# EAGLE design B301 (EAGLE 6.6.0)
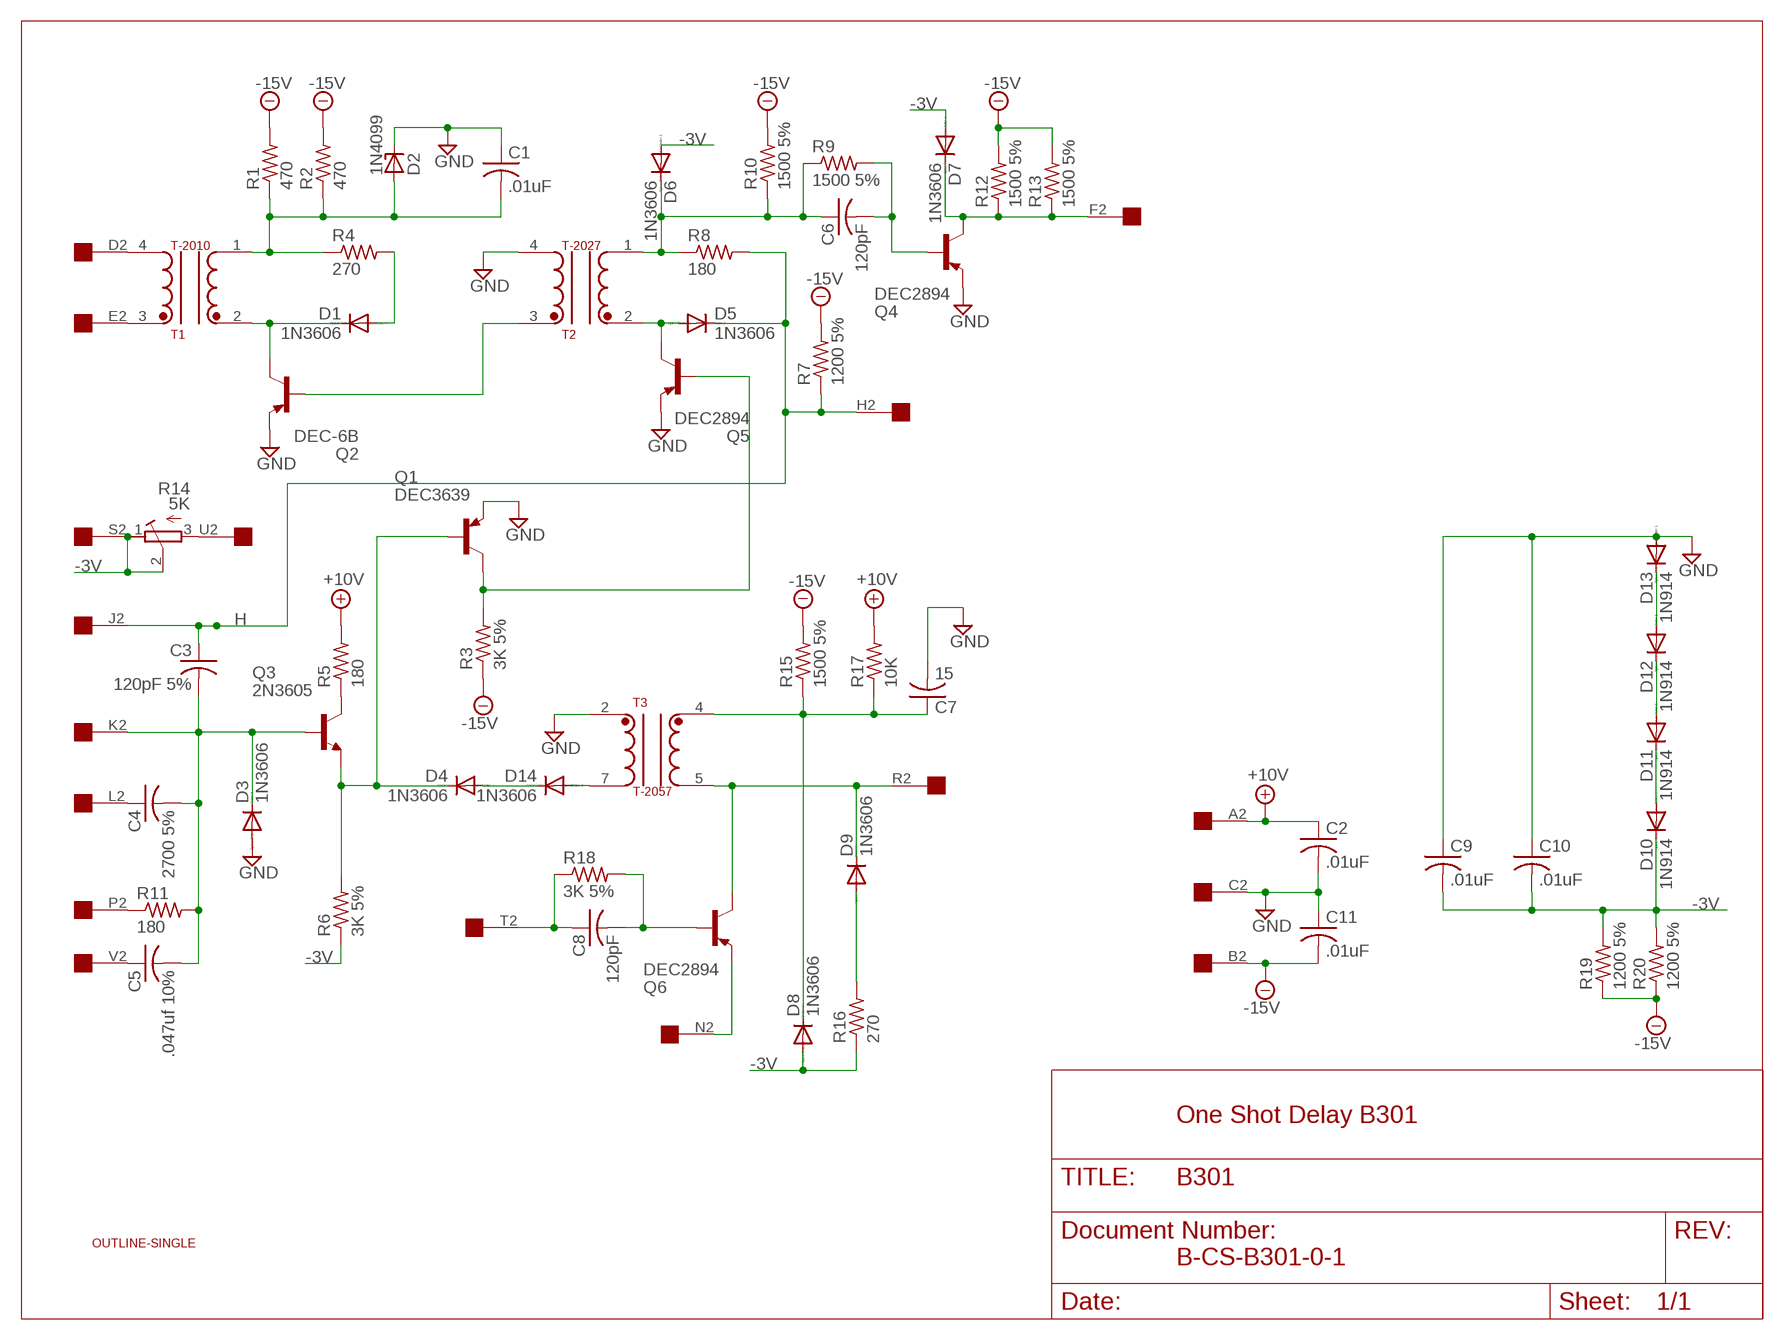
[diagram p0: schematic, sheet 1]

## Parts
C1  .01uF  C-US050-025X075  [C050-025X075]
C2  .01uF  C-US050-025X075  [C050-025X075]
C3  120pF 5%  C-US050-025X075  [C050-025X075]
C4  2700 5%  C-US102-043X133  [C102-043X133]
C5  .047uf 10%  C-US225-062X268  [C225-062X268]
C6  120pF  C-US050-025X075  [C050-025X075]
C7  15  C-US050-025X075  [C050-025X075]
C8  120pF  C-US050-025X075  [C050-025X075]
C9  .01uF  C-US050-025X075  [C050-025X075]
C10  .01uF  C-US050-025X075  [C050-025X075]
C11  .01uF  C-US050-025X075  [C050-025X075]
D1  1N3606  1N4148DO35-10  [DO35-10]
D2  1N4099  ZENER-DIODEDO35Z10  [DO35Z10]
D3  1N3606  1N4148DO35-10  [DO35-10]
D4  1N3606  1N4148DO35-10  [DO35-10]
D5  1N3606  1N4148DO35-10  [DO35-10]
D6  1N3606  1N4148DO35-10  [DO35-10]
D7  1N3606  1N4148DO35-10  [DO35-10]
D8  1N3606  1N4148DO35-10  [DO35-10]
D9  1N3606  1N4148DO35-10  [DO35-10]
D10  1N914  1N4148DO35-10  [DO35-10]
D11  1N914  1N4148DO35-10  [DO35-10]
D12  1N914  1N4148DO35-10  [DO35-10]
D13  1N914  1N4148DO35-10  [DO35-10]
D14  1N3606  1N4148DO35-10  [DO35-10]
Q1  DEC3639  2N2904  [TO39]
Q2  DEC-6B  2N2904  [TO39]
Q3  2N3605  2N2102-NPN-TO39-EBC  [TO39]
Q4  DEC2894  2N2904  [TO39]
Q5  DEC2894  2N2904  [TO39]
Q6  DEC2894  2N2904  [TO39]
R1  470  R-US_0207/10  [0207/10]
R2  470  R-US_0207/10  [0207/10]
R3  3K 5%  R-US_0207/10  [0207/10]
R4  270  R-US_0207/10  [0207/10]
R5  180  R-US_0207/10  [0207/10]
R6  3K 5%  R-US_0207/10  [0207/10]
R7  1200 5%  R-US_0207/10  [0207/10]
R8  180  R-US_0207/10  [0207/10]
R9  1500 5%  R-US_0207/10  [0207/10]
R10  1500 5%  R-US_0207/10  [0207/10]
R11  180  R-US_0207/10  [0207/10]
R12  1500 5%  R-US_0207/10  [0207/10]
R13  1500 5%  R-US_0207/10  [0207/10]
R14  5K  275P  [3006Y]
R15  1500 5%  R-US_0207/10  [0207/10]
R16  270  R-US_0207/10  [0207/10]
R17  10K  R-US_0207/10  [0207/10]
R18  3K 5%  R-US_0207/10  [0207/10]
R19  1200 5%  R-US_0207/10  [0207/10]
R20  1200 5%  R-US_0207/10  [0207/10]
T1  T-2010  [TRANSFORMER2]
T2  T-2027  T-2010  [TRANSFORMER2]
T3  T-2057  T-2037  [TRANSFORMER]
U$1  OUTLINE-SINGLE  [SINGLE]
U$2  EDGE-1  [EDGE-CON1]

## Nets
+10V: C2.1 R5.2 R17.2 U$2.A2
-3V [Supply]: C9.2 C10.2 D6.A D7.A D8.A D10.C R6.1 R14.1(A) R14.2(S) R16.1 R19.2 R20.2 U$2.S2
-15V: C11.2 R1.2 R2.2 R3.1 R7.2 R10.2 R12.2 R13.2 R15.2 R19.1 R20.1 U$2.B2
GND [Supply]: C1.1 C2.2 C7.2 C9.1 C10.1 C11.1 D2.C D3.A D13.A Q1.1(E) Q2.1(E) Q4.1(E) Q5.1(E) T2.4 T3.2 U$2.C2
H: C3.1 D5.C R7.1 R8.2 U$2.H2 U$2.J2
N$1: D7.C Q4.3(C) R12.1 R13.1 U$2.F2
N$2: C6.2 Q4.2(B) R9.2
N$3: D4.A D14.C
N$4: C3.2 C4.2 C5.2 D3.C Q3.2(B) R11.2 U$2.K2
N$5: R14.3(E) U$2.U2
N$6: C4.1 U$2.L2
N$7: C5.1 U$2.V2
N$8: Q2.2(B) T2.3
N$9: D1.C Q2.3(C) T1.2
N$10: R11.1 U$2.P2
N$11: Q3.3(C) R5.1
N$12: C1.2 D2.A R1.1 R2.1 R4.1 T1.1
N$13: D1.A R4.2
N$14: D5.A Q5.3(C) T2.2
N$15: D4.C Q1.2(B) Q3.1(E) R6.2
N$16: C6.1 D6.C R8.1 R9.1 R10.1 T2.1
N$17: Q1.3(C) Q5.2(B) R3.2
N$18: D14.A T3.7
N$19: D9.C Q6.3(C) T3.5 U$2.R2
N$20: Q6.1(E) U$2.N2
N$21: C8.2 Q6.2(B) R18.2
N$22: C8.1 R18.1 U$2.T2
N$23: C7.1 D8.C R15.1 R17.1 T3.4
N$24: D9.A R16.2
N$26: D12.A D13.C
N$27: D11.A D12.C
N$29: D10.A D11.C
N$41: T1.3 U$2.E2
N$42: T1.4 U$2.D2
Unconnected: U$2.M2

## Notes on the sheet
- One Shot Delay B301
- B-CS-B301-0-1

## Library data of the parts
C1-C11 = rcl:C-US: CAPACITOR, American symbol
D1 D3-D14 = diode:1N4148: DIODE high speed (Philips)
D2 = diode:ZENER-DIODE: Z-Diode
Q1 Q2 Q4-Q6 = transistor-pnp:2N2904*: PNP Transistror
Q3 = transistor:*-NPN-: NPN Transistror BF959 corrected 2008.03.06
R1-R13 R15-R20 = rcl:R-US_: RESISTOR, American symbol
R14 = dec-con:275P: Trimpot with 275P (3006Y) footprint.
T1 T2 = dec-con:T-2010: Button Transformer
T3 = dec-con:T-2037: T-2037 Transformer
U$1 = dec-con:OUTLINE-*: Board outlines for DEC boards.
U$2 = dec-con:EDGE-1: Single-Sided DEC Edge Connector -- (side 2)

## Net classes
1 Supply: width 0.813 mm

## Board
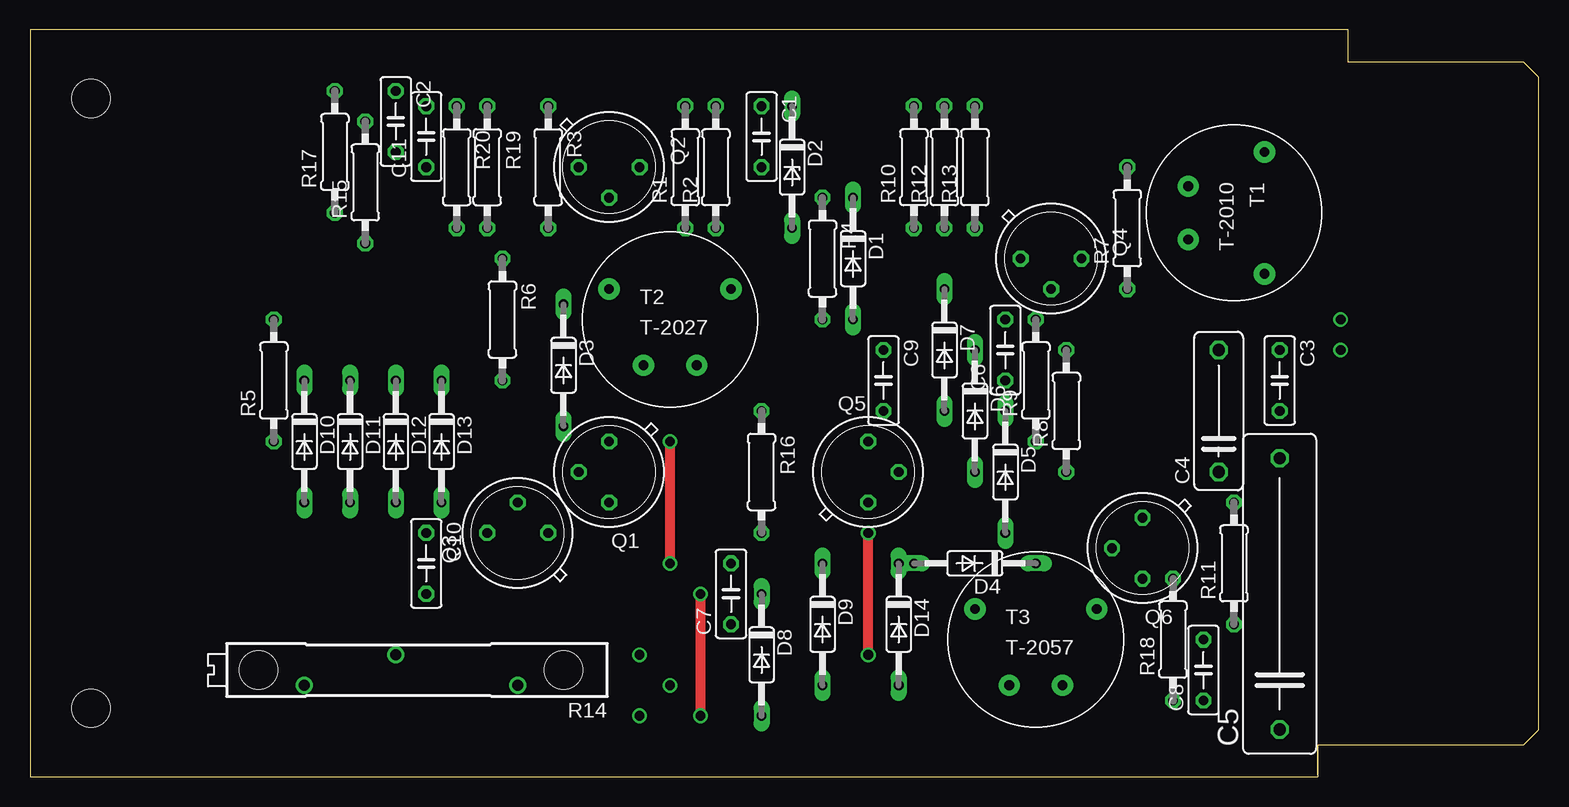
[diagram p1: board, top side]
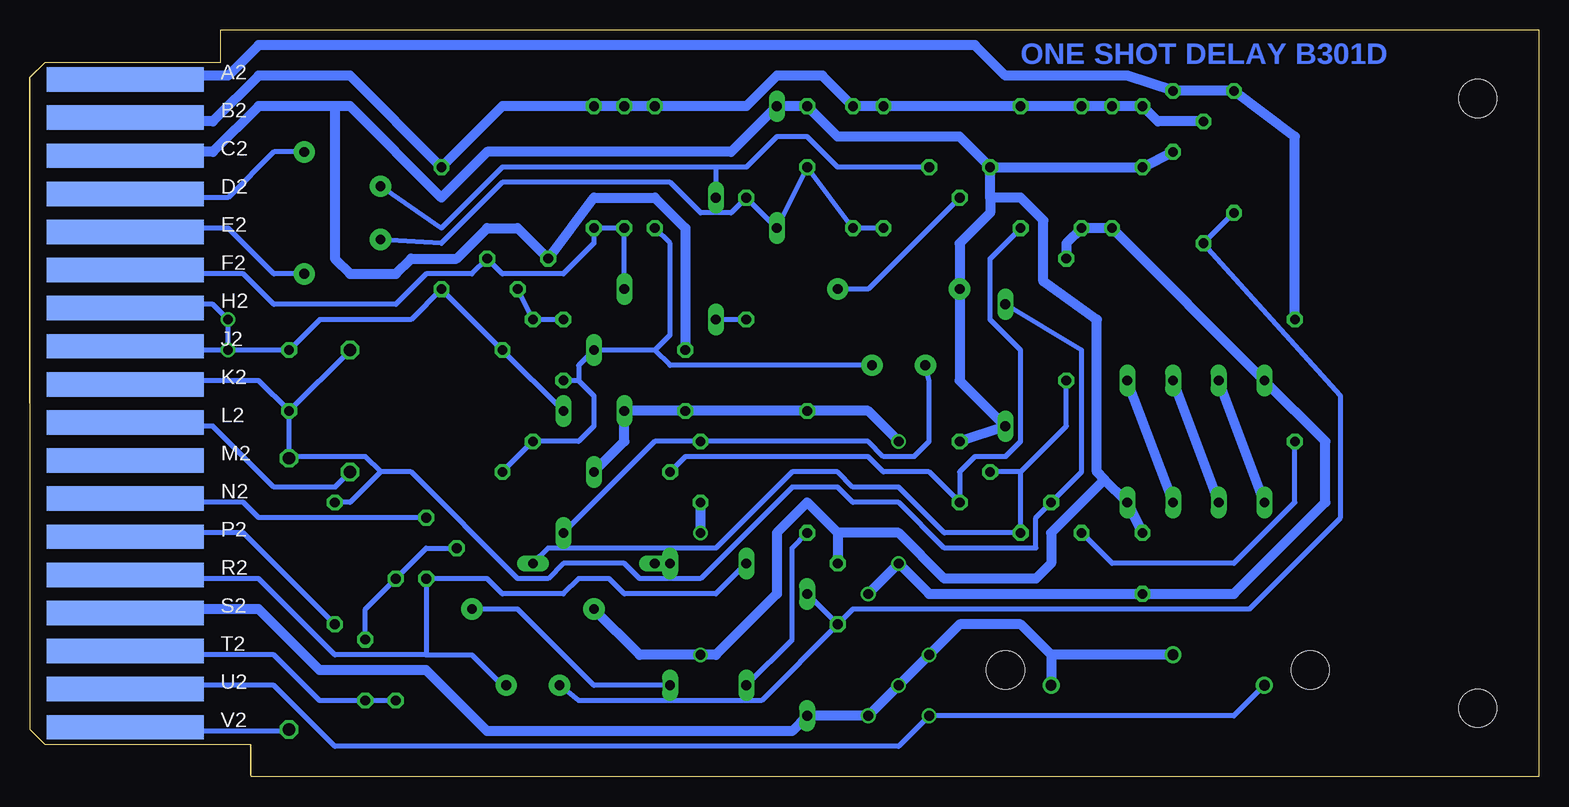
[diagram p2: board, bottom side, seen from below]

Size 125.73 x 62.23 mm. Coordinates in mm from the lower left corner, seen from the top.
Copper layers (1+16): Top 0.035mm / dielectric 1.5mm / Bottom 0.035mm
Design rules "16mils": minimum track width 16mil, minimum drill 32mil, track to track 15mil, track to pad 10mil, pad to pad 10mil, via to via 10mil, smd to smd 10mil, copper to edge 13mil, drill to drill 10mil, minimum pad ring 10mil, minimum via ring 8mil, stop-mask expansion 0mil, vias tented up to drill 0mil, thermal gap 10mil
Holes 3.17 mm at 19.05,8.89 44.45,8.89

### Footprints (pad centres in the part's own frame; a part is rotated, then mirrored left to right if it is on the bottom)
C050-025X075 = drill 0.813 octagon: 1 -2.54,0; 2 2.54,0
C102-043X133 = drill 1.016 octagon: 1 -5.08,0; 2 5.08,0
C225-062X268 = drill 1.016 octagon: 1 -11.303,0; 2 11.303,0
DO35-10 = drill 0.813 long: A 5.08,0; C -5.08,0
DO35Z10 = drill 0.813 long: A 5.08,0; C -5.08,0
TO39 = drill 0.813 octagon: 1 0,-2.54; 2 2.54,0; 3 0,2.54
0207/10 = drill 0.813 octagon: 1 -5.08,0; 2 5.08,0
3006Y = drill 0.9: 1 -8.89,1.27; 2 1.27,-1.27; 3 8.89,1.27
TRANSFORMER2 = drill 0.813 pad 1.778: 1 2.223,-3.81; 2 -2.223,-3.81; 3 5.08,2.54; 4 -5.08,2.54
TRANSFORMER = drill 0.813 pad 1.778: 2 -5.08,2.54; 4 -2.223,-3.81; 5 2.223,-3.81; 7 5.08,2.54
SINGLE = hole 3.175: 120.65,56.515; 120.65,5.715
EDGE-CON1 = smd 13.106 x 2.032 bottom: A2 7.938,4.128; B2 7.938,7.303; C2 7.938,10.477; D2 7.938,13.652; E2 7.938,16.828; F2 7.938,20.003; H2 7.938,23.177; J2 7.938,26.352; K2 7.938,29.527; L2 7.938,32.703; M2 7.938,35.877; N2 7.938,39.053; P2 7.938,42.227; R2 7.938,45.403; S2 7.938,48.578; T2 7.938,51.752; U2 7.938,54.928; V2 7.938,58.102

### Placement (x,y rotation side)
C1  60.96,53.34 270 top
C2  30.48,54.61 270 top
C3  104.14,33.02 270 top
C4  99.06,30.48 90 top
C5  104.14,15.24 90 top
C6  81.28,35.56 90 top
C7  58.42,15.24 90 top
C8  97.79,8.89 90 top
C9  71.12,33.02 270 top
C10  33.02,17.78 270 top
C11  33.02,53.34 90 top
D1  68.58,43.18 270 top
D2  63.5,50.8 270 top
D3  44.45,34.29 270 top
D4  78.74,17.78 180 top
D5  81.28,25.4 270 top
D6  78.74,30.48 270 top
D7  76.2,35.56 270 top
D8  60.96,10.16 270 top
D9  66.04,12.7 270 top
D10  22.86,27.94 270 top
D11  26.67,27.94 270 top
D12  30.48,27.94 270 top
D13  34.29,27.94 270 top
D14  72.39,12.7 270 top
Q1  48.26,25.4 180 top
Q2  48.26,50.8 270 top
Q3  40.64,20.32 90 top
Q4  85.09,43.18 270 top
Q5  69.85,25.4 0 top
Q6  92.71,19.05 180 top
R1  54.61,50.8 90 top
R2  57.15,50.8 90 top
R3  43.18,50.8 270 top
R4  66.04,43.18 270 top
R5  20.32,33.02 90 top
R6  39.37,38.1 270 top
R7  91.44,45.72 90 top
R8  86.36,30.48 90 top
R9  83.82,33.02 90 top
R10  73.66,50.8 90 top
R11  100.33,17.78 90 top
R12  76.2,50.8 90 top
R13  78.74,50.8 90 top
R14  31.75,8.89 180 top
R15  27.94,49.53 90 top
R16  60.96,25.4 270 top
R17  25.4,52.07 90 top
R18  95.25,11.43 90 top
R19  38.1,50.8 270 top
R20  35.56,50.8 270 top
T1  100.33,46.99 270 top
T2  53.34,38.1 0 top
T3  83.82,11.43 0 top
U$1  125.73,62.23 180 top
U$2  125.73,62.23 180 top

### Tracks (layer width: path | path; a pad name or v marks a point on that pad's centre or on a via)
+10V
  Bottom 0.813: U$2.A2 116.84,58.42 109.22,58.42 106.68,60.96 46.99,60.96 44.45,58.42 34.29,58.42 C2.1 R17.2 20.32,53.34 R5.2
-3V  (via drill 0.81)
  Top 0.813: v55.88,5.08 v55.88,15.24 | v53.34,17.78 v53.34,27.94
  Bottom 0.813: R14.2 40.64,10.16 | 40.64,10.16 R14.1 | 40.64,10.16 43.18,12.7 48.26,12.7 v50.8,10.16 v53.34,7.62 v55.88,5.08 D8.A 62.23,3.81 87.63,3.81 92.71,8.89 101.6,8.89 106.68,13.97 116.84,13.97 U$2.S2 | v55.88,15.24 v53.34,17.78 50.8,15.24 C10.2 25.4,15.24 17.78,22.86 17.78,27.94 D10.C R20.2 R19.2 39.37,44.45 R6.1 | v53.34,27.94 55.88,30.48 R16.1 C9.2 D7.A 76.2,27.94 D6.A
-15V
  Bottom 0.813: U$2.B2 116.84,54.61 110.49,54.61 106.68,58.42 99.06,58.42 R7.2 86.36,55.88 R13.2 R12.2 R10.2 66.04,55.88 63.5,58.42 59.69,58.42 R2.2 R1.2 R3.1 R19.1 R20.1 C11.2 31.75,54.61 R15.2
GND  (via drill 0.81)
  Top 0.813: v69.85,10.16 v69.85,20.32
  Bottom 0.813: U$2.C2 116.84,52.07 110.49,52.07 106.68,55.88 100.33,55.88 | Q2.1 48.26,53.34 58.42,53.34 C1.1 D2.C 67.31,52.07 87.63,52.07 91.44,48.26 99.06,55.88 100.33,55.88 | v69.85,20.32 Q5.1 | T3.2 74.93,10.16 v69.85,10.16 68.58,10.16 63.5,15.24 63.5,20.32 60.96,22.86 58.42,20.32 | C2.2 C11.1 Q2.1 | Q1.1 D3.A 48.26,33.02 T2.4 48.26,44.45 45.72,46.99 45.72,48.26 | 36.2,24.77 D13.A C10.1 | 36.2,24.77 36.83,25.4 36.83,38.1 41.27,41.27 41.27,46.35 43.18,48.26 45.72,48.26 | 45.72,48.26 Q2.1 | 100.33,55.88 100.33,43.18 99.06,41.91 95.25,41.91 93.98,43.18 90.17,43.18 87.63,45.72 85.09,45.72 Q4.1 78.74,48.26 73.66,48.26 71.12,45.72 C9.1 | 58.42,20.32 C7.2 | 58.42,20.32 53.34,20.32 49.53,16.51 41.91,16.51 40.64,17.78 40.64,20.32 36.2,24.77
H  (via drill 0.81)
  Bottom 0.406: U$2.J2 116.84,35.56 v109.22,35.56 | U$2.H2 116.84,39.37 110.49,39.37 v109.22,38.1 v109.22,35.56 | v109.22,35.56 C3.1 101.6,38.1 93.98,38.1 R7.1 R8.2 D5.C
N$1
  Bottom 0.406: U$2.F2 116.84,41.91 107.95,41.91 105.41,39.37 95.25,39.37 92.71,41.91 88.9,41.91 Q4.3 86.36,41.91 81.28,41.91 78.74,44.45 R13.1 R12.1 D7.C
N$2
  Bottom 0.406: C6.2 R9.2 Q4.2
N$3
  Bottom 0.406: D14.C D4.A
N$4
  Bottom 0.406: U$2.K2 116.84,33.02 106.68,33.02 C3.2 | 104.14,26.67 C5.2 | 104.14,26.67 C3.2 | C3.2 C4.2 | D3.C 38.1,35.56 38.1,25.4 Q3.2 41.91,21.59 41.91,19.05 49.53,19.05 53.34,22.86 57.15,22.86 58.42,24.13 62.23,24.13 69.85,16.51 74.93,16.51 76.2,17.78 81.28,17.78 82.55,16.51 85.09,16.51 93.98,25.4 96.52,25.4 | R11.2 99.06,22.86 96.52,25.4 | 96.52,25.4 97.79,26.67 104.14,26.67
N$5  (via drill 0.81)
  Bottom 0.406: R14.3 25.4,5.08 v50.8,5.08 53.34,2.54 100.33,2.54 105.41,7.62 116.84,7.62 U$2.U2
N$6
  Bottom 0.406: U$2.L2 116.84,29.21 110.49,29.21 105.41,24.13 100.33,24.13 C4.1
N$7
  Bottom 0.406: U$2.V2 116.84,3.81 104.14,3.81 C5.1
N$8
  Bottom 0.406: T2.3 55.88,40.64 Q2.2
N$9
  Bottom 0.406: Q2.3 58.42,50.8 60.96,53.34 63.5,53.34 66.04,50.8 68.58,50.8 | T1.2 91.44,45.72 86.36,50.8 68.58,50.8 | 68.58,50.8 D1.C
N$10
  Bottom 0.406: U$2.P2 116.84,20.32 107.95,20.32 R11.1
N$11
  Bottom 0.406: Q3.3 35.56,17.78 25.4,17.78 20.32,22.86 R5.1
N$12
  Bottom 0.406: T1.1 91.44,44.45 86.36,49.53 72.39,49.53 69.85,46.99 67.31,46.99 R4.1 D2.A C1.2 R2.1 R1.1
N$13
  Bottom 0.406: R4.2 D1.A
N$14
  Bottom 0.406: T2.2 50.8,33.02 50.8,27.94 52.07,26.67 54.61,26.67 55.88,27.94 Q5.3 73.66,27.94 D5.A
N$15
  Bottom 0.406: 43.18,25.4 Q3.1 49.53,20.32 53.34,24.13 57.15,24.13 58.42,25.4 62.23,25.4 68.58,19.05 82.55,19.05 D4.C | 43.18,25.4 Q1.2 | 43.18,25.4 39.37,29.21 R6.2
N$16
  Bottom 0.406: R8.1 R9.1 80.01,27.94 78.74,29.21 78.74,31.75 80.01,33.02 | T2.1 72.39,34.29 73.66,35.56 | 73.66,35.56 D6.C 80.01,34.29 80.01,33.02 | 80.01,33.02 C6.1 | R10.1 72.39,44.45 72.39,36.83 73.66,35.56
N$17
  Bottom 0.406: Q5.2 71.12,26.67 55.88,26.67 54.61,25.4 50.8,25.4 Q1.3 48.26,25.4 46.99,26.67 44.45,26.67 43.18,27.94 43.18,35.56 45.72,38.1 45.72,43.18 R3.2
N$18
  Bottom 0.406: T3.7 85.09,13.97 78.74,7.62 D14.A
N$19
  Bottom 0.406: U$2.R2 116.84,16.51 106.68,16.51 100.33,10.16 92.71,10.16 | 92.71,10.16 88.9,10.16 86.36,7.62 T3.5 | 92.71,10.16 Q6.3 87.63,16.51 86.36,15.24 81.28,15.24 80.01,16.51 77.47,16.51 76.2,15.24 68.58,15.24 D9.C
N$20
  Bottom 0.406: U$2.N2 116.84,22.86 107.95,22.86 106.68,21.59 Q6.1
N$21
  Bottom 0.406: Q6.2 92.71,19.05 R18.2 97.79,13.97 C8.2
N$22
  Bottom 0.406: U$2.T2 116.84,10.16 105.41,10.16 101.6,6.35 C8.1 R18.1
N$23
  Bottom 0.406: R17.1 R15.1 16.51,31.75 16.51,21.59 24.13,13.97 57.15,13.97 C7.1 | C7.1 D8.C | T3.4 80.01,6.35 64.77,6.35 C7.1
N$24
  Bottom 0.406: D9.A 62.23,11.43 62.23,19.05 R16.2
N$26
  Bottom 0.813: D12.A D13.C
N$27
  Bottom 0.813: D11.A D12.C
N$29
  Bottom 0.813: D10.A D11.C
N$41
  Bottom 0.406: U$2.E2 116.84,45.72 109.22,45.72 105.41,41.91 T1.3
N$42
  Bottom 0.406: U$2.D2 116.84,48.26 109.22,48.26 105.41,52.07 T1.4

### Text on the board
Bottom: ONE SHOT DELAY B301D
tDocu: Layout does not match B301D